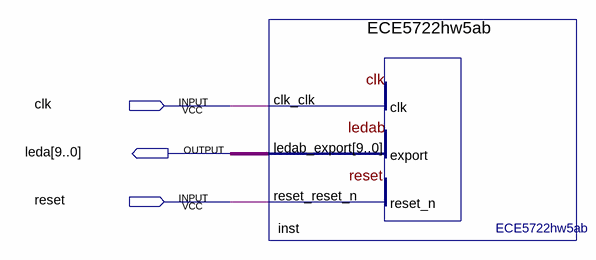
[diagram p0: schematic sheet]
// Quartus schematic ECE5722hw5b1ver2.bdf as structural Verilog: 1 symbols, 3 pins
module ECE5722hw5b1ver2 (
  input  clk,
  input  reset,
  output [9:0] leda
);

  ECE5722hw5ab inst (.clk_clk(clk), .reset_reset_n(reset), .ledab_export(leda));
endmodule
